# EAGLE design RelayBoard2 (EAGLE 6.1)
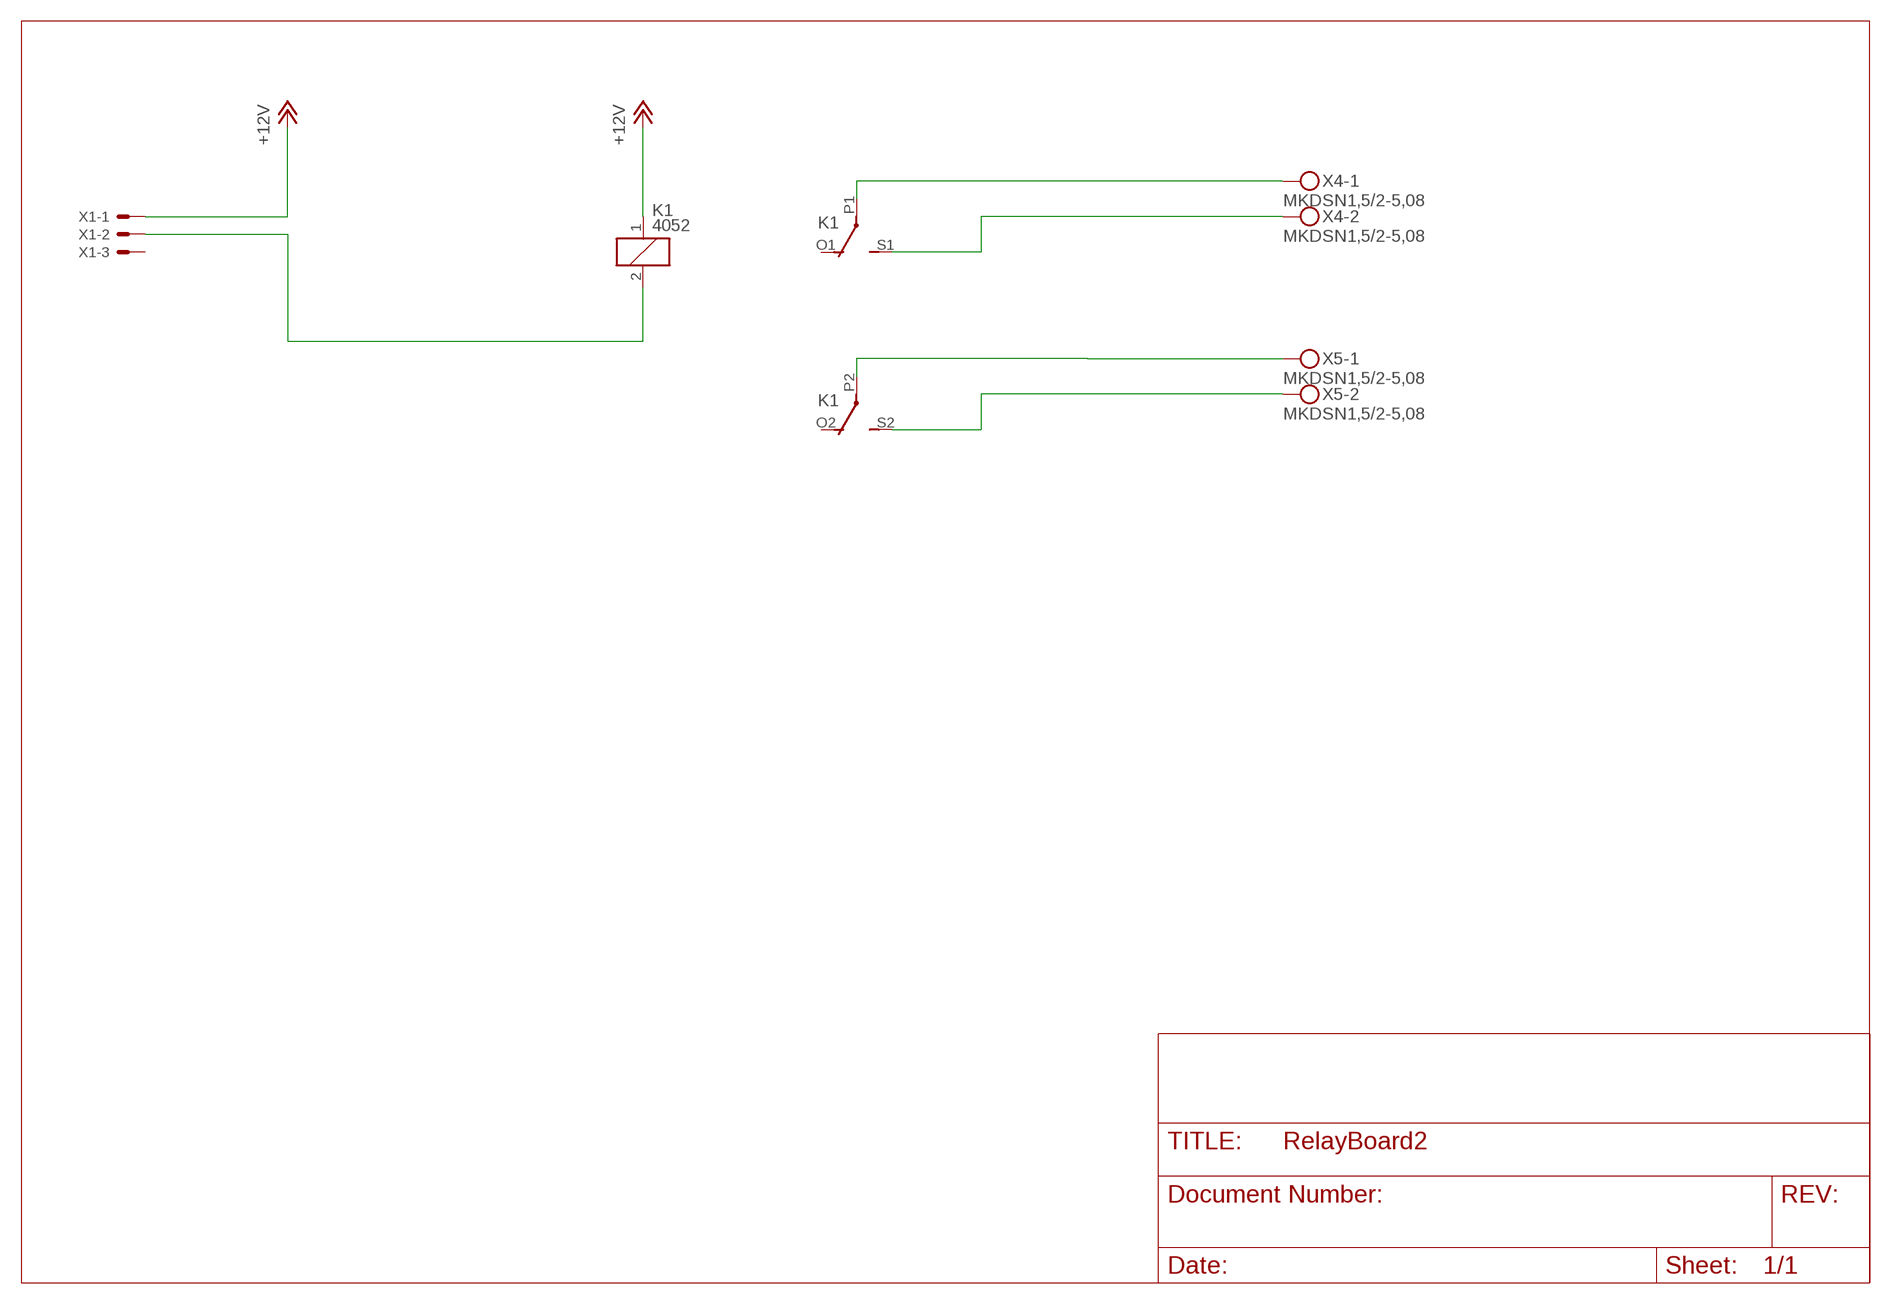
[diagram p0: schematic, sheet 1]

## Parts
K1  4052  [F4052]
X1  KK-156-3  [KK-156-3]
X4  MKDSN1,5/2-5,08  [MKDSN1,5/2-5,08]
X5  MKDSN1,5/2-5,08  [MKDSN1,5/2-5,08]

## Nets
+12V: K1.1 X1.1
N$2: K1.2 X1.2
N$3: K1.P2(3:P) X5.1
N$4: K1.S2(3:S) X5.2
N$6: K1.S1(2:S) X4.2
N$7: K1.P1(2:P) X4.1
Unconnected: K1.O1(2:O) K1.O2(3:O) X1.3

## Library data of the parts
K1 = relay:4052: RELAY 2 x switch, Finder; OC_FARNELL: unknown; OC_NEWARK: unknown
X1 = con-molex:KK-156-3: KK 156 HEADER Source: http://www.molex.com/pdm_docs/sd/026604100_sd.pdf; OC_FARNELL: unknown; OC_NEWARK: unknown
X4 X5 = con-phoenix-508:MKDSN1,5/2-5,08: MKDSN 1,5/ 2-5,08 Printklemme Nennstrom: 13,5 A Nennspannung: 250 V Rastermaß: 5,08 mm Polzahl: 2 Anschlussart: Schraubanschluss Montage: Löten Anschlussrichtung Leiter/Platine: 0 ° Artikelnummer: 1729128 Source: http://eshop.phoenixcontact.com .. 1729128.pdf; MPN: MKDSN 1,5/2-5.08; OC_FARNELL: 1792903; OC_NEWARK: 30M2397

## Board
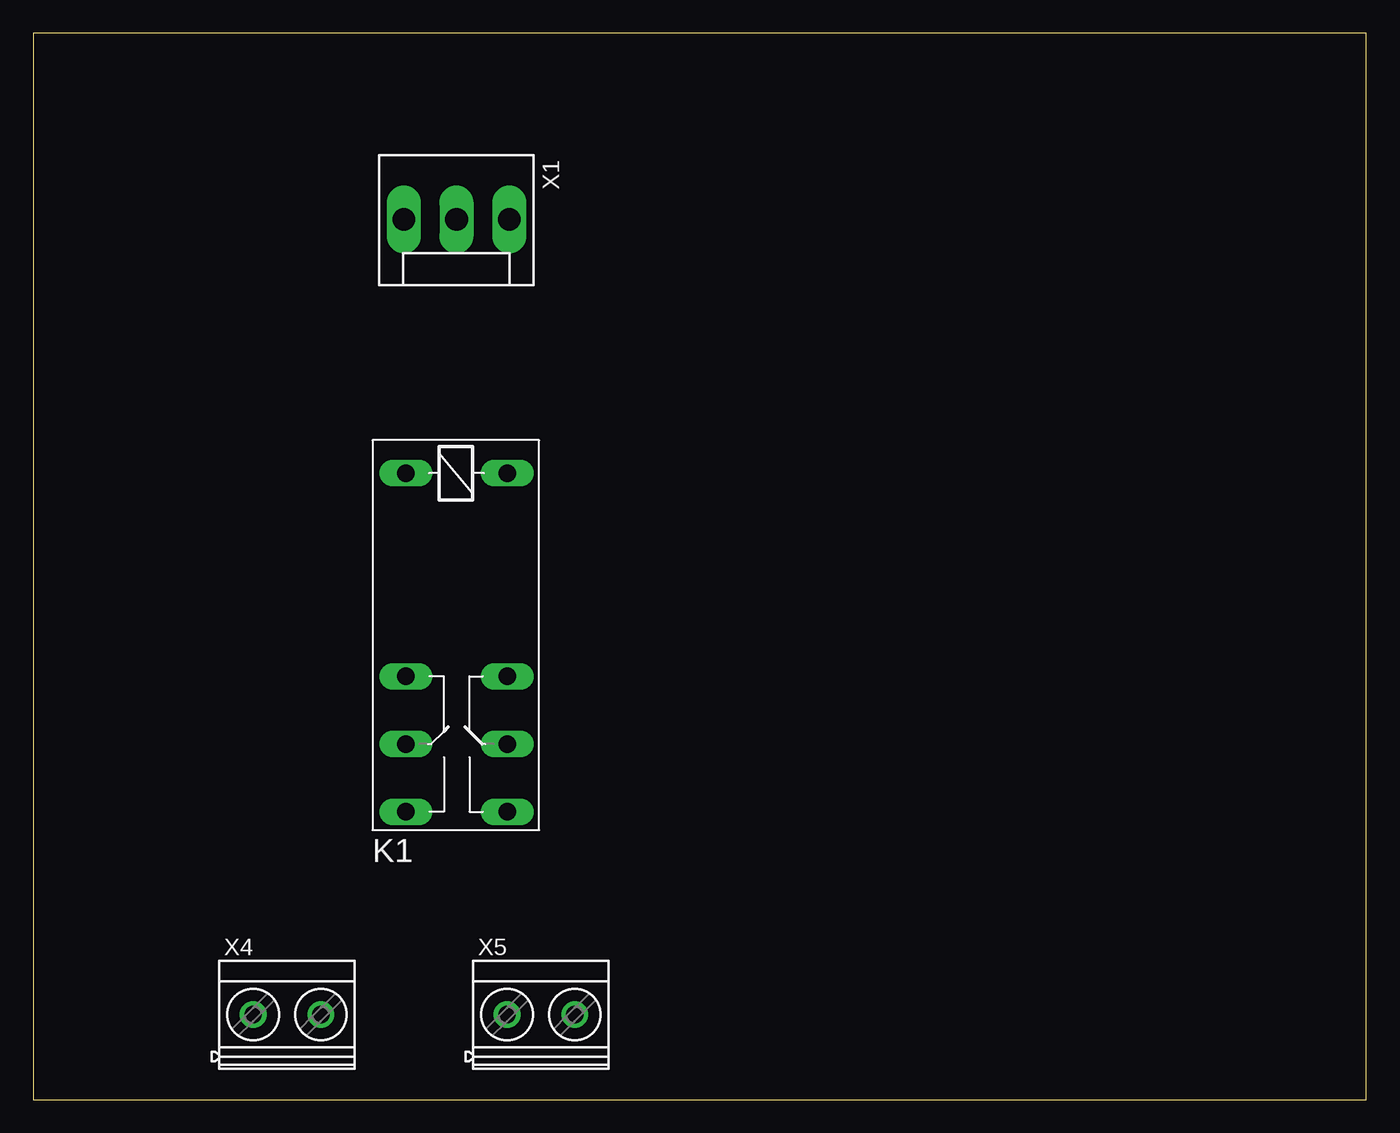
[diagram p1: board, top side]
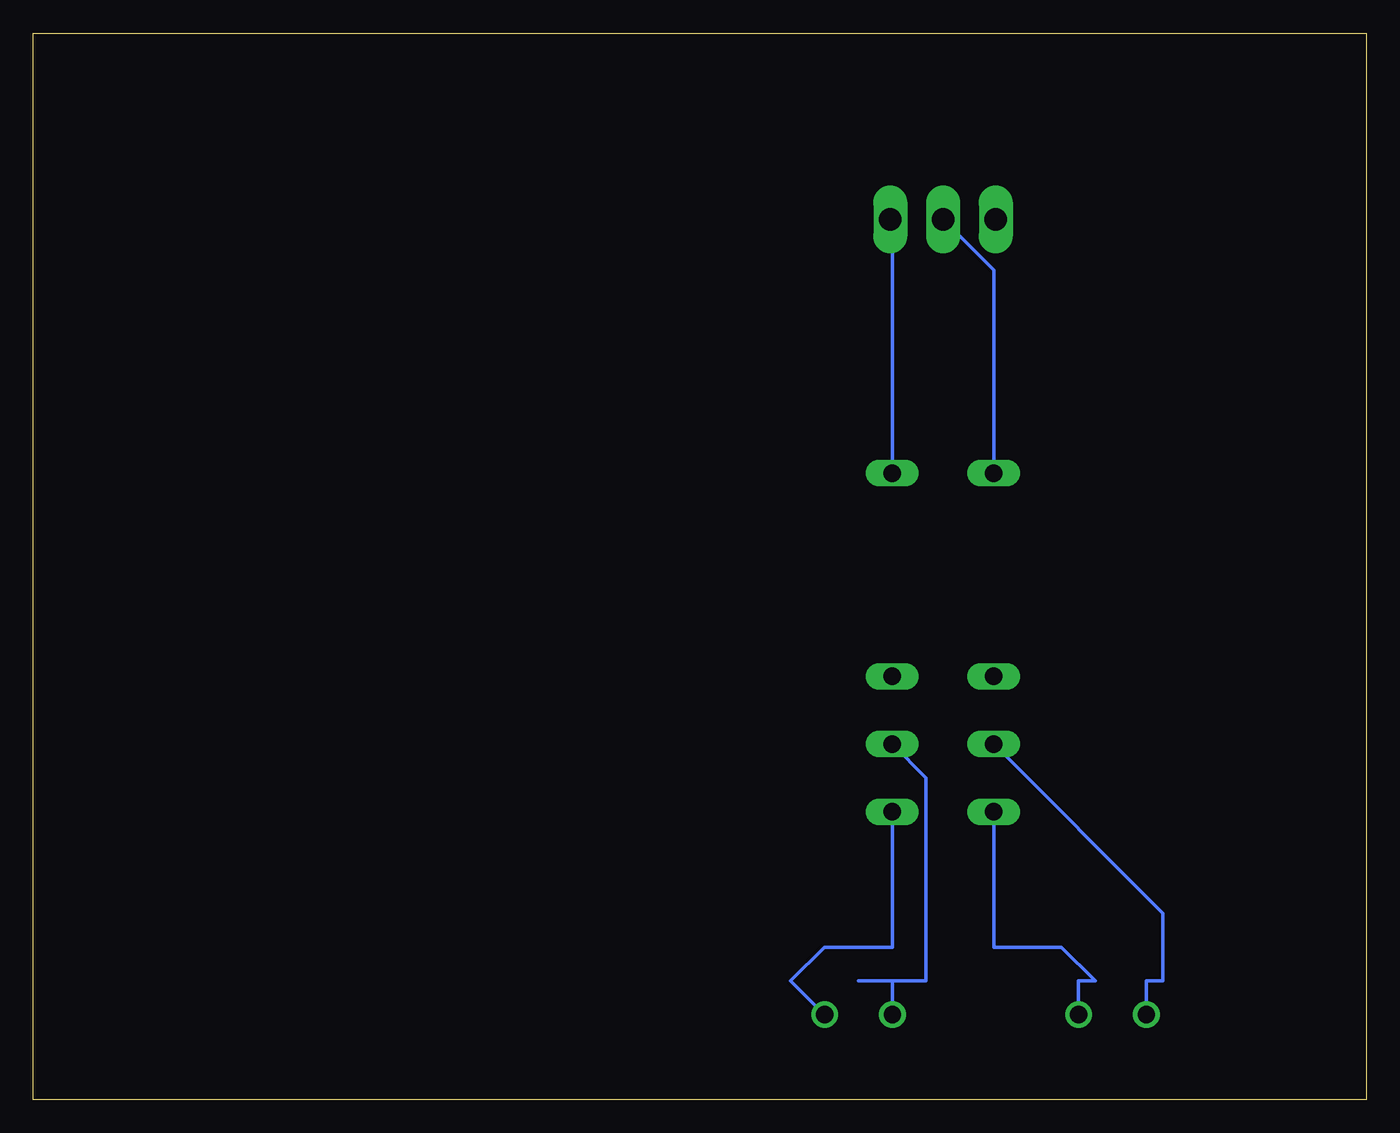
[diagram p2: board, bottom side, seen from below]

Size 100 x 80 mm. Coordinates in mm from the lower left corner, seen from the top.
Outline: 0,0 100,0 100,80 0,80 0,0
Copper layers (1*16): Top 0.035mm / dielectric 1.5mm / Bottom 0.035mm
Design rules: minimum track width 10mil, minimum drill 24mil, track to track 8mil, track to pad 8mil, pad to pad 8mil, via to via 8mil, smd to smd 8mil, copper to edge 40mil, drill to drill 8mil, minimum pad ring 10mil, minimum via ring 8mil, stop-mask expansion 4mil, vias tented up to drill 0mil, thermal gap 10mil

### Footprints (pad centres in the part's own frame; a part is rotated, then mirrored left to right if it is on the bottom)
F4052 = drill 1.321 long: 1 -3.81,3.81; 2 -3.81,-3.81; O1 11.43,-3.81; O2 11.43,3.81; P1 16.51,-3.81; P2 16.51,3.81; S1 21.59,-3.81; S2 21.59,3.81
KK-156-3 = drill 1.7 pad 2.184 long: 1 -3.96,0; 2 0,0; 3 3.96,0
MKDSN1,5/2-5,08 = drill 1.3 pad 2: 1 -2.561,0.025; 2 2.519,0.025

### Placement (x,y rotation side)
K1  31.75,43.18 270 top
X1  31.75,66.04 180 top
X4  19.05,6.35 0 top
X5  38.1,6.35 0 top

### Tracks (layer width: path | path; a pad name or v marks a point on that pad's centre or on a via)
+12V
  Bottom 0.254: K1.1 35.56,66.04 X1.1
N$2
  Bottom 0.254: K1.2 27.94,62.23 X1.2
N$3
  Bottom 0.254: K1.P2 33.02,24.13 33.02,8.89 35.56,8.89 | 38.1,8.89 35.56,8.89 | 35.56,8.89 35.56,6.35 X5.1
N$4
  Bottom 0.254: K1.S2 35.56,11.43 40.64,11.43 43.18,8.89 40.64,6.35 X5.2
N$6
  Bottom 0.254: K1.S1 27.94,11.43 22.86,11.43 20.32,8.89 21.59,8.89 21.59,6.35 X4.2
N$7
  Bottom 0.254: K1.P1 15.24,13.97 15.24,8.89 16.51,8.89 16.51,6.35 X4.1